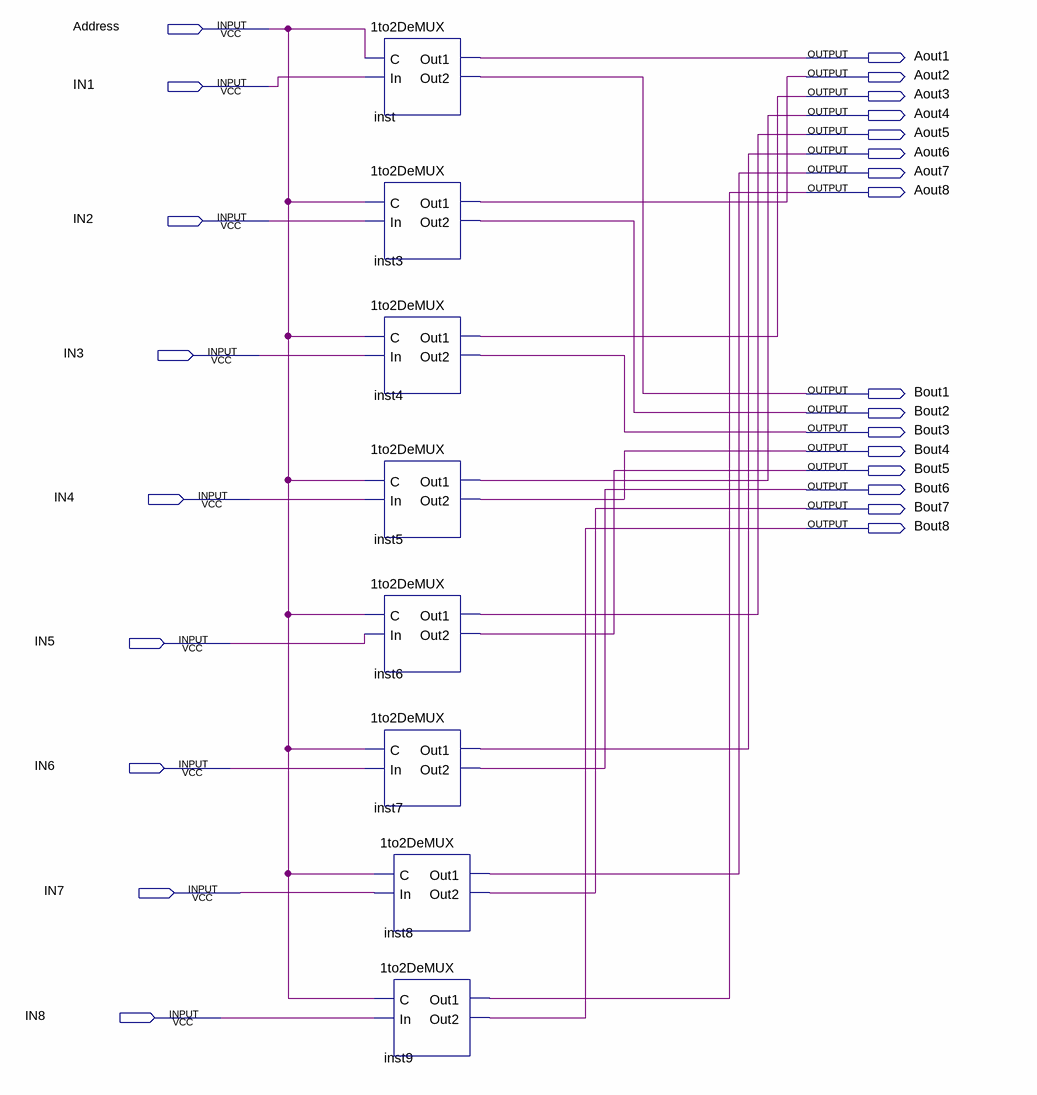
[diagram p0: schematic sheet]
// Quartus schematic DeMUX8.bdf as structural Verilog: 8 symbols, 25 pins
module DeMUX8 (
  input  Address,
  input  IN1,
  input  IN2,
  input  IN3,
  input  IN4,
  input  IN5,
  input  IN6,
  input  IN7,
  input  IN8,
  output Aout1,
  output Aout2,
  output Aout3,
  output Aout4,
  output Aout5,
  output Aout6,
  output Aout7,
  output Aout8,
  output Bout1,
  output Bout2,
  output Bout3,
  output Bout4,
  output Bout5,
  output Bout6,
  output Bout7,
  output Bout8
);

  \1to2DeMUX  inst (.C(Address), .In(IN1), .Out1(Aout1), .Out2(Bout1));
  \1to2DeMUX  inst3 (.C(Address), .In(IN2), .Out1(Aout2), .Out2(Bout2));
  \1to2DeMUX  inst4 (.C(Address), .In(IN3), .Out1(Aout3), .Out2(Bout3));
  \1to2DeMUX  inst5 (.C(Address), .In(IN4), .Out1(Aout4), .Out2(Bout4));
  \1to2DeMUX  inst6 (.C(Address), .In(IN5), .Out1(Aout5), .Out2(Bout5));
  \1to2DeMUX  inst7 (.C(Address), .In(IN6), .Out1(Aout6), .Out2(Bout6));
  \1to2DeMUX  inst8 (.C(Address), .In(IN7), .Out1(Aout7), .Out2(Bout7));
  \1to2DeMUX  inst9 (.C(Address), .In(IN8), .Out1(Aout8), .Out2(Bout8));
endmodule
